# Altium schematic sheet LoRaWan.SchDoc
size A4
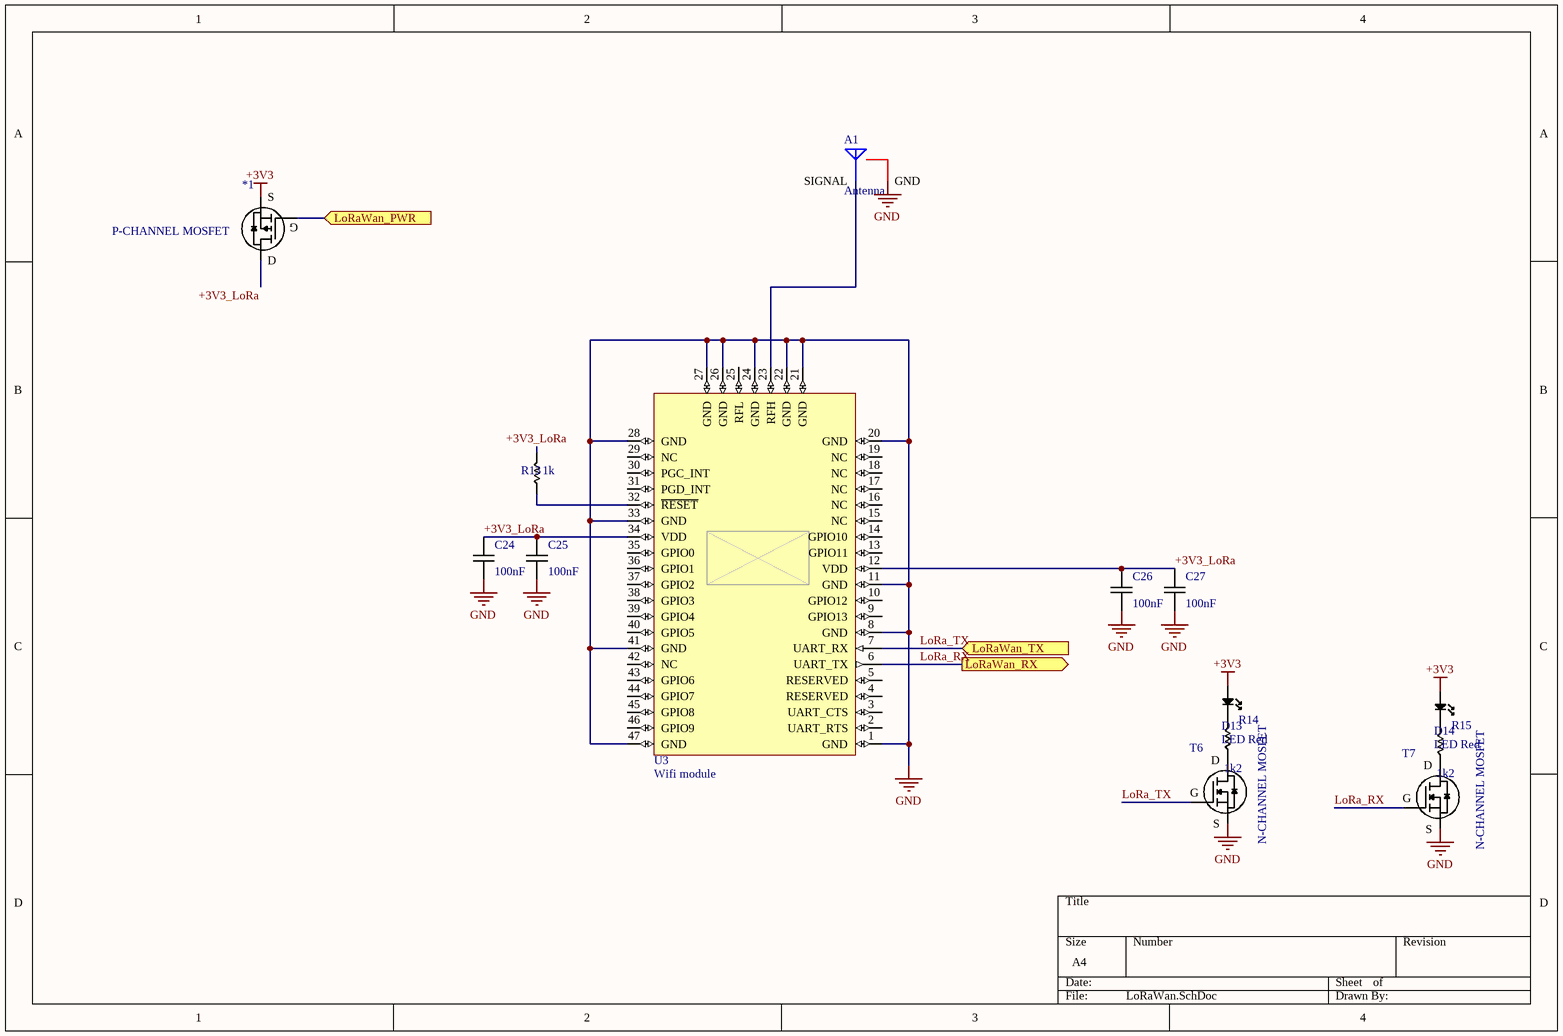
[diagram p0: LoRaWan.SchDoc]

## Parts
*1  P-CHANNEL MOSFET  [P-CHANNEL MOSFET]
A1  Antenna  [uFL SMD]
C24  value 100nF  [C0603]  (hidden comment: Capacitor 0603)
C25  value 100nF  [C0603]  (hidden comment: Capacitor 0603)
C26  value 100nF  [C0603]  (hidden comment: Capacitor 0603)
C27  value 100nF  [C0603]  (hidden comment: Capacitor 0603)
D13  LED Red  [L0603 RED]
D14  LED Red  [L0603 RED]
R13  value 1k  [R0603]  (hidden comment: Resistor 0603)
R14  value 1k2  [R0603]  (hidden comment: Resistor 0603)
R15  value 1k2  [R0603]  (hidden comment: Resistor 0603)
T6  N-CHANNEL MOSFET  [2N7002]
T7  N-CHANNEL MOSFET  [2N7002]
U3  Wifi module  [RN2483A]

## Ports
LoRaWan_PWR (in), LoRaWan_RX (out), LoRaWan_TX (in)

## Nets
+3V3: *1.2(S) D13.1 D14.1
GND: A1.2(GND) C24.1 C25.1 C26.1 C27.1 T6.2(S) T7.2(S) U3.1(GND) U3.8(GND) U3.11(GND) U3.20(GND) U3.21(GND) U3.22(GND) U3.24(GND) U3.26(GND) U3.27(GND) U3.28(GND) U3.33(GND) U3.41(GND) U3.47(GND)
+3V3_LoRa: *1.3(D) C24.2 C25.2 C26.2 C27.2 R13.2 U3.12(VDD) U3.34(VDD)
LoRa_RX: T7.1(G) U3.6(UART_TX) ; port LoRaWan_RX
LoRa_TX: T6.1(G) U3.7(UART_RX) ; port LoRaWan_TX
LoRaWan_PWR: *1.1(G) ; port LoRaWan_PWR
NetA1_1: A1.1(SIGNAL) U3.23(RFH)
NetD13_2: D13.2 R14.2
NetD14_2: D14.2 R15.2
NetR13_1: R13.1 U3.32(~{RESET})
NetR14_1: R14.1 T6.3(D)
NetR15_1: R15.1 T7.3(D)

Not connected (* = marked no-connect by the designer): U3 2(UART_RTS) 3(UART_CTS) 4(RESERVED) 5(RESERVED) 9(GPIO13) 10(GPIO12) 13(GPIO11) 14(GPIO10) 15(NC) 16(NC) 17(NC) 18(NC) 19(NC) 25(RFL) 29(NC) 30(PGC_INT) 31(PGD_INT) 35(GPIO0) 36(GPIO1) 37(GPIO2) 38(GPIO3) 39(GPIO4) 40(GPIO5) 42(NC) 43(GPIO6) 44(GPIO7) 45(GPIO8) 46(GPIO9)

## Library data of the parts
A1 = uFL SMD
D13 D14 = LED 0603 Red
T6 T7 = 2N7002
U3 = LoRaWan module: RN2483A